# EAGLE design splitter (EAGLE 7.3.0)
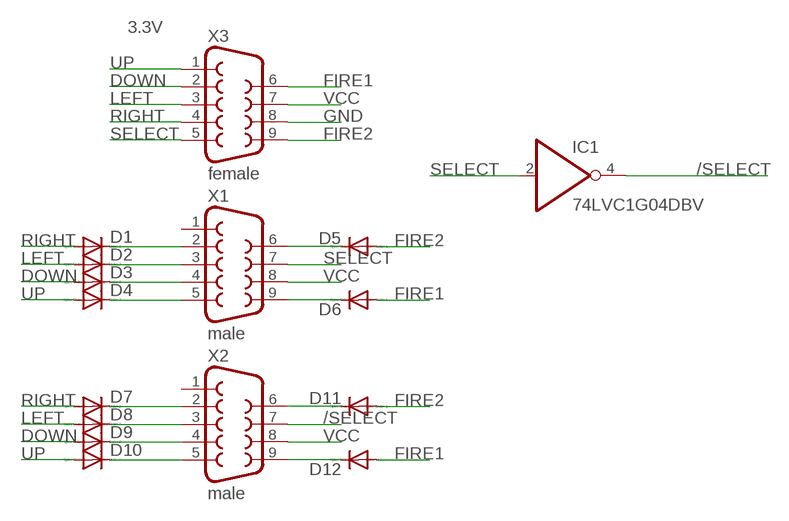
[diagram p0: schematic, sheet 1]

## Parts
D1  DIODE-SOD323-R  [SOD323-R]
D2  DIODE-SOD323-R  [SOD323-R]
D3  DIODE-SOD323-R  [SOD323-R]
D4  DIODE-SOD323-R  [SOD323-R]
D5  DIODE-SOD323-R  [SOD323-R]
D6  DIODE-SOD323-R  [SOD323-R]
D7  DIODE-SOD323-R  [SOD323-R]
D8  DIODE-SOD323-R  [SOD323-R]
D9  DIODE-SOD323-R  [SOD323-R]
D10  DIODE-SOD323-R  [SOD323-R]
D11  DIODE-SOD323-R  [SOD323-R]
D12  DIODE-SOD323-R  [SOD323-R]
IC1  74LVC1G04DBV  [SOT23-5]
X1  male  F09D  [F09D]
X2  male  F09D  [F09D]
X3  female  F09D  [F09D]

## Nets
/SELECT: IC1.4(O) X2.7
DOWN: D3.A D9.A X3.2
FIRE1: D6.A D12.A X3.6
FIRE2: D5.A D11.A X3.9
GND: X3.8
LEFT: D2.A D8.A X3.3
N$3: D2.C X1.3
N$4: D8.C X2.3
N$5: D1.C X1.2
N$6: D3.C X1.4
N$7: D7.C X2.2
N$8: D9.C X2.4
N$9: D10.C X2.5
N$10: D4.C X1.5
N$11: D6.C X1.9
N$12: D5.C X1.6
N$13: D12.C X2.9
N$14: D11.C X2.6
RIGHT: D1.A D7.A X3.4
SELECT: IC1.2(I) X1.7 X3.5
UP: D4.A D10.A X3.1
VCC: X1.8 X2.8 X3.7
Unconnected: X1.1 X2.1

## Power pins joined to a net without a drawn wire
GND: IC1.3(GND)
VCC: IC1.5(VCC)

## Library data of the parts
D1-D12 = diode:DIODE-: DIODE
IC1 = 74xx-little-de:74*1G04: INVERTER Gate
X1-X3 = con-subd:F09: SUB-D; OC_FARNELL: unknown; OC_NEWARK: unknown

## Board
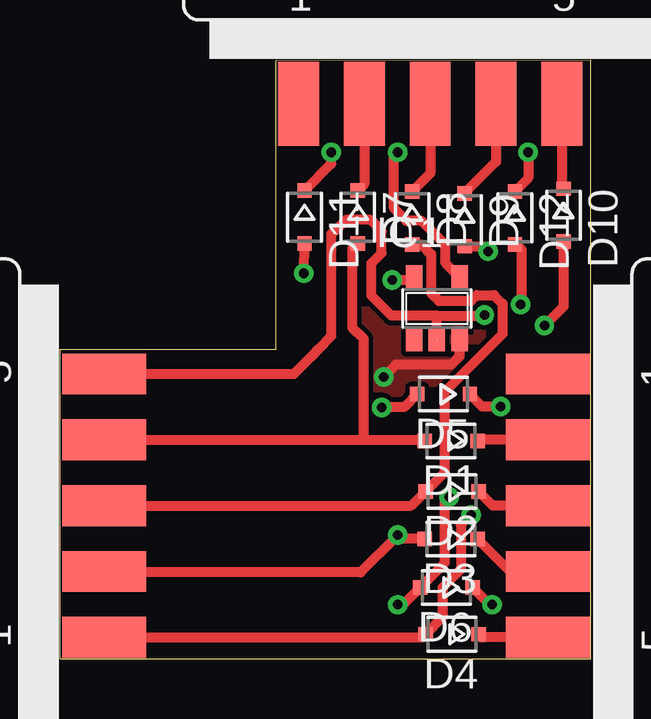
[diagram p1: board, top side]
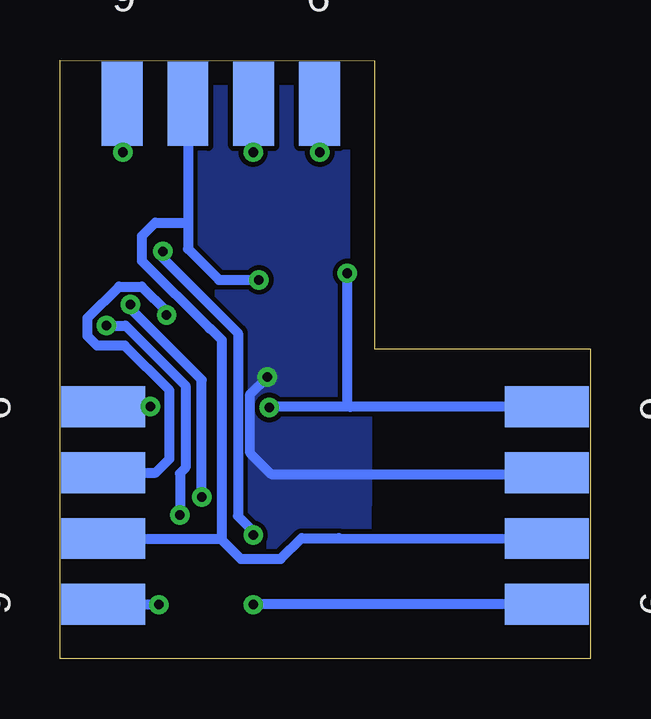
[diagram p2: board, bottom side, seen from below]

Size 22.15 x 24.96 mm. Coordinates in mm from the lower left corner, seen from the top.
Outline: 9.02,24.92 22.15,24.96 22.15,0 0.01,0
Outline: 0,0 0,12.9 9.01,12.9 9.01,24.92
Copper layers (1*16): Top 0.035mm / dielectric 1.5mm / Bottom 0.035mm
Design rules "default": minimum track width 10mil, minimum drill 24mil, track to track 8mil, track to pad 8mil, pad to pad 8mil, via to via 8mil, smd to smd 8mil, copper to edge 40mil, drill to drill 8mil, minimum pad ring 10mil, minimum via ring 8mil, stop-mask expansion 4mil, vias tented up to drill 0mil, thermal gap 10mil

### Footprints (pad centres in the part's own frame; a part is rotated, then mirrored left to right if it is on the bottom)
SOD323-R = smd 0.6 x 0.6: A 1.1,0; C -1.1,0
SOT23-5 = smd 0.69 x 0.99: 1 -0.95,-1.29; 2 0,-1.29; 3 0.95,-1.29; 4 0.95,1.3; 5 -0.95,1.3
F09D = smd 1.7 x 3.5: 1 -5.486,-6.045; 2 -2.743,-6.045; 3 0,-6.045; 4 2.743,-6.045; 5 5.486,-6.045 | smd 1.7 x 3.5 bottom: 6 -4.115,-6.045; 7 -1.372,-6.045; 8 1.372,-6.045; 9 4.115,-6.045

### Placement (x,y rotation side)
D1  16.31,9.09 180 top
D2  16.35,6.99 180 top
D3  16.31,5 180 top
D4  16.35,1.03 180 top
D5  15.99,11.03 180 top
D6  16.11,2.98 180 top
D7  12.42,18.41 270 top
D8  14.68,18.38 270 top
D9  16.87,18.3 270 top
D10  20.99,18.49 270 top
D11  10.2,18.41 270 top
D12  18.97,18.38 270 top
IC1  15.72,14.61 0 top
X1  26.39,6.39 270 top
X2  15.44,29.17 0 top
X3  -4.21,6.39 90 top

### Tracks (layer width: path | path; a pad name or v marks a point on that pad's centre or on a via)
/SELECT  (via drill 0.4)
  Top 0.406: IC1.4 16.07,16.5 16.07,17.26 15.08,18.26 14.45,18.26 13.93,18.77 13.93,20.95 v14.09,21.11
  Bottom 0.406: X2.7 14.07,21.14 v14.09,21.11
DOWN  (via drill 0.4)
  Top 0.406: D3.A 14.25,5 v14.09,5.16 12.54,3.61 1.88,3.61 X3.2 | D9.A 17.65,17.2 v17.86,16.99
  Bottom 0.406: v14.09,5.16 14.09,5.32 14.72,5.95 14.72,13.57 17.86,16.71 v17.86,16.99
FIRE1  (via drill 0.4)
  Top 0.406: v14.09,2.26 14.3,2.26 D6.A 16.03,4 16.03,6.55 v16.23,6.75 | D12.A 19.04,17.27 19.25,17.07 19.25,14.8 v19.21,14.76
  Bottom 0.406: X3.6 14.08,2.27 v14.09,2.26 | v19.21,14.76 19.21,14.61 16.23,11.63 v16.23,6.75
FIRE2  (via drill 0.4)
  Top 0.406: v13.41,10.48 13.45,10.52 14.38,10.52 D5.A | D11.A 10.17,17.32 v10.16,16.07
  Bottom 0.406: v13.41,10.48 13.39,10.5 10.04,10.5 | v10.16,16.07 10.16,10.62 10.04,10.5 | X3.9 10.04,10.5
GND  (via drill 0.4)
  Top 0.406: IC1.3 16.67,12.62 16.31,12.26 14.01,12.26 v13.49,11.75
  Bottom 0.406: v13.49,11.75 14.21,11.03 14.21,8.57 13.34,7.7 1.9,7.7 X3.8
  pour Bottom: 9.37,0.28 9.25,24.61 21.95,24.69 21.87,0.28
  pour Top: 9.37,0.28 9.25,24.61 21.95,24.69 21.87,0.28
LEFT
  Top 0.406: X3.3 14.66,6.39 D2.A 16.03,7.77 16.03,11.11 18.45,13.53 18.45,14.8 18.1,15.16 17.38,15.16 17.14,14.92 15.8,14.92 15.48,15.24 15.48,16.87 15.07,17.27 D8.A
N$3
  Top 0.406: X1.3 18.05,6.39 D2.C
N$4
  Top 0.406: X2.3 15.44,20.23 D8.C
N$5
  Top 0.406: X1.2 17.46,9.13 D1.C
N$6
  Top 0.406: X1.4 18.77,3.65 D3.C
N$7
  Top 0.406: X2.2 12.7,19.79 D7.C
N$8
  Top 0.406: X2.4 18.18,20.71 D9.C
N$9
  Top 0.406: X2.5 20.93,19.66 D10.C
N$10
  Top 0.406: X1.5 17.58,0.9 D4.C
N$11  (via drill 0.4)
  Top 0.406: v18.02,2.26 18.02,2.37 17.82,2.37 D6.C
  Bottom 0.406: X1.9 18.03,2.27 v18.02,2.26
N$12  (via drill 0.4)
  Top 0.406: v18.38,10.52 17.61,10.52 D5.C
  Bottom 0.406: X1.6 18.39,10.5 v18.38,10.52
N$13  (via drill 0.4)
  Top 0.406: v19.53,21.11 19.53,20.03 D12.C
  Bottom 0.406: X2.9 19.55,21.14 v19.53,21.11
N$14  (via drill 0.4)
  Top 0.406: D11.C 11.31,20.63 v11.31,21.11
  Bottom 0.406: X2.6 11.32,21.13 v11.31,21.11
RIGHT
  Top 0.406: X3.4 12.7,9.13 | 12.7,9.13 15.17,9.13 D1.A | 12.7,9.13 12.66,9.17 12.66,13.34 12.18,13.81 12.18,17.08 D7.A 12.42,17.22
SELECT  (via drill 0.4)
  Top 0.406: 15.72,14.31 17.68,14.31 v17.7,14.33 | IC1.2 15.72,14.31 | 15.72,14.31 13.83,14.31 12.98,15.16 12.98,16.47 13.41,16.91 13.41,17.82 12.94,18.3 11.95,18.3 11.31,17.7 11.31,13.45 10.78,12.9 | 10.78,12.9 10.52,12.62 | X3.5 9.76,11.88 10.78,12.9
  Bottom 0.406: X1.7 18.16,7.76 17.58,8.33 17.58,11.19 19.45,13.06 20.6,13.06 21,13.45 21,14.21 19.68,15.52 18.73,15.52 17.7,14.49 v17.7,14.33
UP  (via drill 0.4)
  Top 0.406: X3.1 15.12,0.9 D4.A 15.95,1.74 15.95,2.98 16.71,3.73 16.71,5.6 17.11,5.99 v17.14,5.99 | D10.A 21,14.68 v20.2,13.89
  Bottom 0.406: v20.2,13.89 19.41,13.89 16.91,11.39 16.91,7.98 17.14,7.74 v17.14,5.99
VCC  (via drill 0.4)
  Top 0.406: v13.85,15.8 14.66,15.8 IC1.5
  Bottom 0.406: X1.8 15.46,5.02 | 15.46,5.02 14.61,4.17 12.94,4.17 12.06,5.04 10.51,5.04 X3.7 | v13.85,15.8 15.52,15.8 16.81,17.09 16.81,18.14 | X2.8 16.81,18.14 | 16.81,18.14 16.85,18.18 18.18,18.18 18.73,17.62 18.73,16.59 15.91,13.77 15.88,13.77 15.4,13.29 15.4,5.08 15.46,5.02